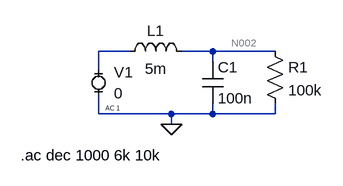
[diagram p0: schematic Draft2.asc]
Draft2.asc, the LTspice schematic file:
Version 4
SHEET 1 880 680
WIRE 160 128 112 128
WIRE 288 128 240 128
WIRE 384 128 288 128
WIRE 288 144 288 128
WIRE 112 160 112 128
WIRE 112 224 112 192
WIRE 224 224 112 224
WIRE 288 224 288 208
WIRE 288 224 224 224
WIRE 384 224 384 208
WIRE 384 224 288 224
WIRE 224 240 224 224
FLAG 224 240 0
SYMBOL MiniSyms4\\voltage- 112 176 R0
WINDOW 123 11 39 Left 0
WINDOW 39 0 0 Left 0
SYMATTR Value2 AC 1
SYMATTR InstName V1
SYMATTR Value 0
SYMBOL ind 144 144 R270
WINDOW 0 32 56 VTop 2
WINDOW 3 5 56 VBottom 2
SYMATTR InstName L1
SYMATTR Value 5m
SYMBOL cap 272 144 R0
SYMATTR InstName C1
SYMATTR Value 100n
SYMBOL res 368 112 R0
SYMATTR InstName R1
SYMATTR Value 100k
TEXT -8 288 Left 2 !.ac dec 1000 6k 10k

The netlist it stands for:
* Draft2.asc
V1 N001 0 0 AC 1
L1 N001 N002 5m
C1 N002 0 100n
R1 N002 0 100k
.ac dec 1000 6k 10k
.backanno
.end

* Results of the author's LTspice run, read from the files saved beside the schematic
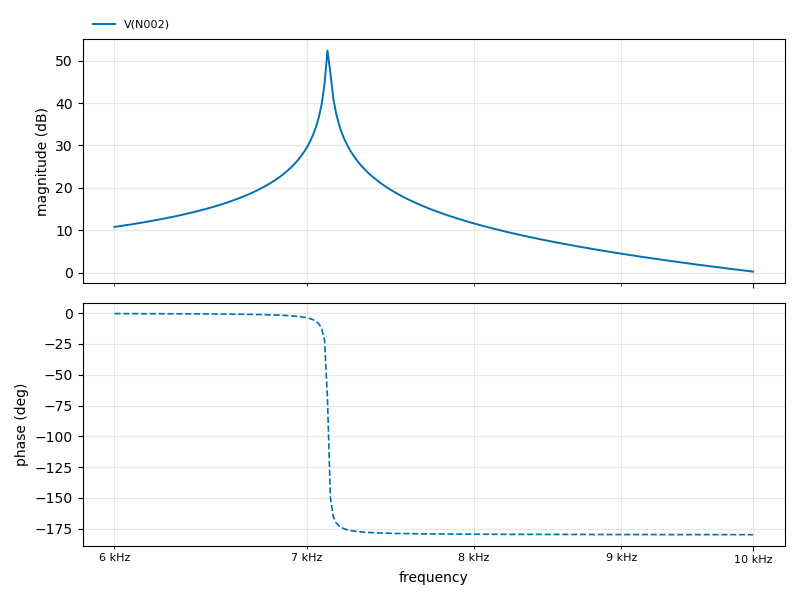
[diagram p1: AC Analysis of Draft2.asc, plotted from the saved traces]
* AC Analysis, 1 run:
*   V(N002): 10.77 dB at 6 kHz, 0.23 dB at 10 kHz, peak 52.42 dB at 7.115 kHz, 3 dB below the peak at 7.108 kHz and 7.124 kHz